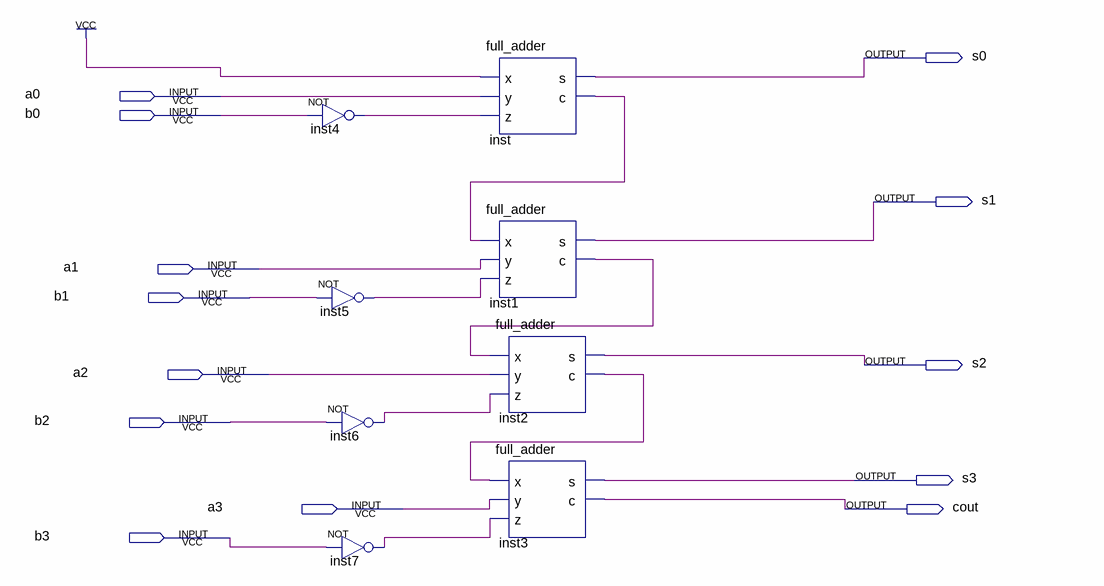
[diagram p0: schematic sheet]
// Quartus schematic subtractorProject.bdf as structural Verilog: 8 symbols, 13 pins
module subtractorProject (
  input  a0,
  input  b0,
  input  a1,
  input  b1,
  input  a2,
  input  b2,
  input  a3,
  input  b3,
  output s0,
  output s1,
  output s2,
  output s3,
  output cout
);

  wire inst1_c, inst2_c, inst4_out, inst5_out, inst6_out, inst7_out, inst_c;

  not inst4 (inst4_out, b0);
  not inst5 (inst5_out, b1);
  not inst6 (inst6_out, b2);
  not inst7 (inst7_out, b3);
  full_adder inst (.x(1'b1), .y(a0), .z(inst4_out), .s(s0), .c(inst_c));
  full_adder inst1 (.x(inst_c), .y(a1), .z(inst5_out), .s(s1), .c(inst1_c));
  full_adder inst2 (.x(inst1_c), .y(a2), .z(inst6_out), .s(s2), .c(inst2_c));
  full_adder inst3 (.x(inst2_c), .y(a3), .z(inst7_out), .s(s3), .c(cout));
endmodule
